# EAGLE design robot_board (EAGLE 9.1.0)
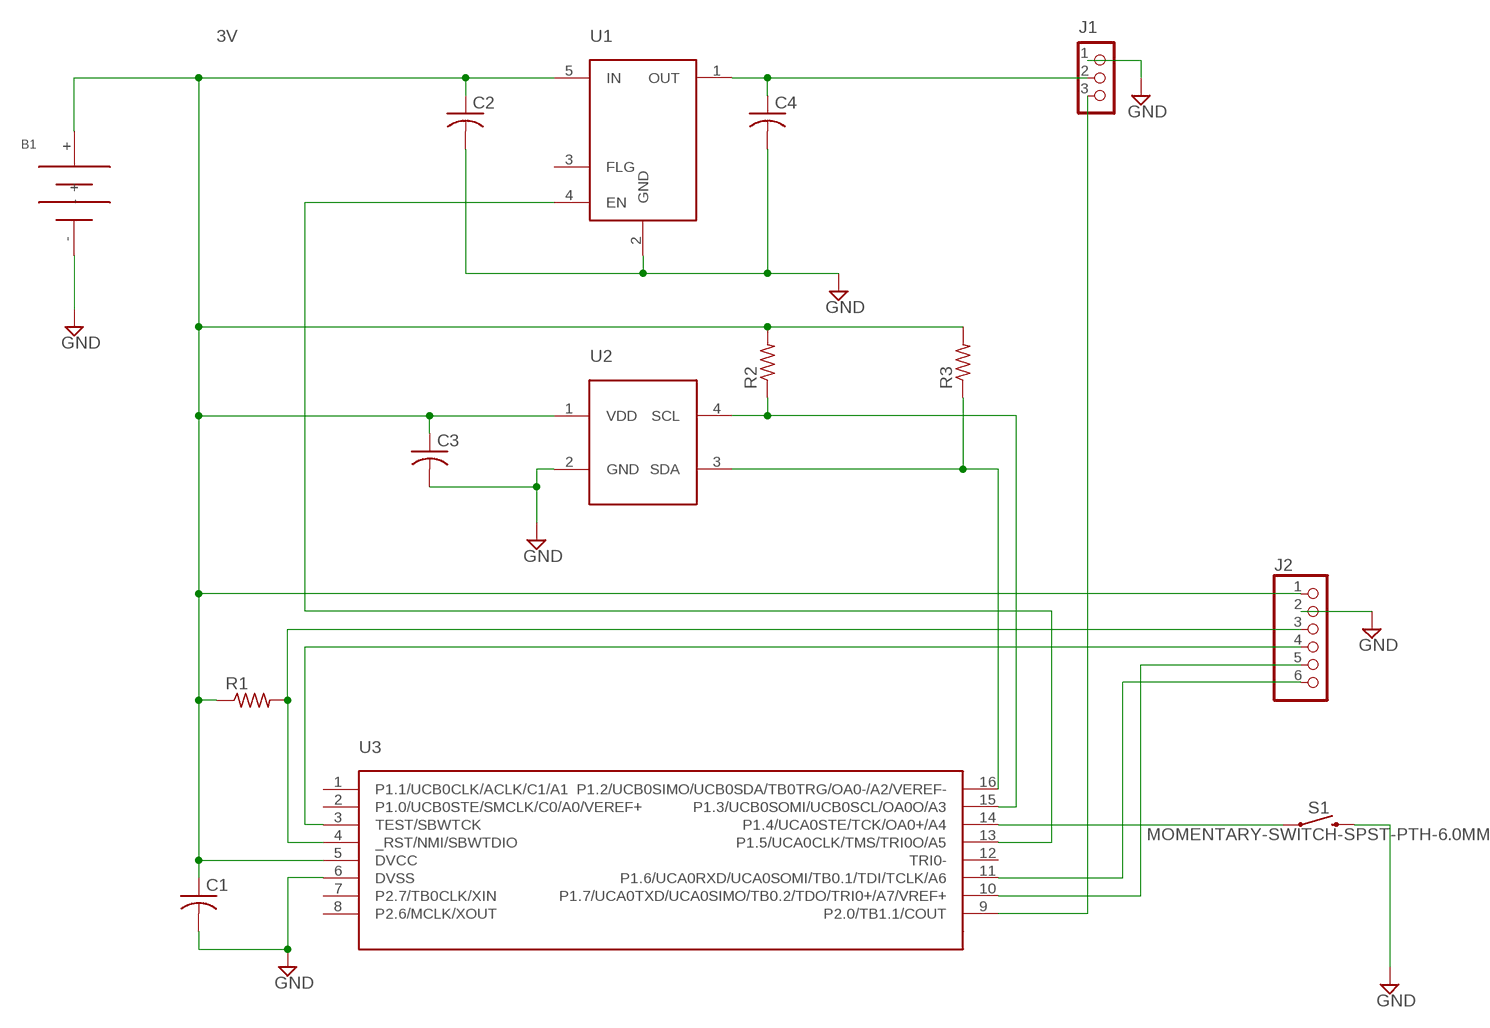
[diagram p0: schematic, sheet 1]

## Parts
B1  2XAAA_HOLDER  [CHEAP_ASS_CHINESE_BH]
C1  C-USC0805  [C0805]
C2  C-USC0805  [C0805]
C3  C-USC0805  [C0805]
C4  C-USC0805  [C0805]
J1  CON_HEADER_1X03-PTH_RIGHT_ANGLED  [M1X3_MALE_RIGHT_ANGLED]
J2  PINHD-1X6  [1X06]
R1  R-US_R0805  [R0805]
R2  R-US_R0805  [R0805]
R3  R-US_R0805  [R0805]
S1  MOMENTARY-SWITCH-SPST-PTH-6.0MM  [TACTILE_SWITCH_PTH_6.0MM]
U1  DI_AP22802AW5-7  [SOT-25]
U2  LITE-ON_LTR-329ALS-01  [LITE-ON_LTR-329ALS-01]
U3  TI_MSP430FR2310IPW16R  [PW_R-PDSO-G16]

## Nets
3V: B1.+ C1.1 C2.1 C3.1 J2.1 R1.1 R2.2 R3.2 U1.5(IN) U2.1(VDD) U3.5(DVCC)
GND: B1.- C1.2 C2.2 C3.2 C4.2 J1.1 J2.2 S1.3 U1.2(GND) U2.2(GND) U3.6(DVSS)
N$1: U1.4(EN) U3.13(P1.5/UCA0CLK/TMS/TRI0O/A5)
N$2: R2.1 U2.4(SCL) U3.15(P1.3/UCB0SOMI/UCB0SCL/OA0O/A3)
N$3: R3.1 U2.3(SDA) U3.16(P1.2/UCB0SIMO/UCB0SDA/TB0TRG/OA0-/A2/VEREF-)
N$4: C4.1 J1.2 U1.1(OUT)
N$6: J2.3 R1.2 U3.4(_RST/NMI/SBWTDIO)
N$7: J1.3 U3.9(P2.0/TB1.1/COUT)
N$8: J2.4 U3.3(TEST/SBWTCK)
N$9: J2.6 U3.11(P1.6/UCA0RXD/UCA0SOMI/TB0.1/TDI/TCLK/A6)
N$10: J2.5 U3.10(P1.7/UCA0TXD/UCA0SIMO/TB0.2/TDO/TRI0+/A7/VREF+)
N$11: S1.1 U3.14(P1.4/UCA0STE/TCK/OA0+/A4)
Unconnected: U1.3(FLG) U3.1(P1.1/UCB0CLK/ACLK/C1/A1) U3.2(P1.0/UCB0STE/SMCLK/C0/A0/VEREF+) U3.7(P2.7/TB0CLK/XIN) U3.8(P2.6/MCLK/XOUT) U3.12(TRI0-)

## Library data of the parts
B1 = pcb_robot:2XAAA_HOLDER
C1-C4 = pcb_robot:C-US: CAPACITOR, American symbol; SPICEPREFIX: C
J1 = pcb_robot:CON_HEADER_1X03
J2 = pinhead:PINHD-1X6: PIN HEADER
R1-R3 = rcl:R-US_: RESISTOR, American symbol; SPICEPREFIX: R
S1 = pcb_robot:MOMENTARY-SWITCH-SPST: Momentary Switch (Pushbutton) - SPST Normally-open (NO) SPST momentary switches (buttons, pushbuttons). Variants PTH-12MM - 12mm square, through-hole Momentary Pushbutton Switch - 12mm Square <https://www.sparkfun.com/products/9190> (COM-09190) PTH-6.0MM, PTH-6.0MM-KIT - 6.0mm square, through-hole Mini Pushbutton Switch <https://www.sparkfun.com/products/97> (COM-00097) KIT package intended for soldering kit's - only one side of pads' copper is exposed. PTH-RIGHT-ANGLE-KIT - Right-angle, through-hole Right Angle Tactile Button <https://www.sparkfun.com/products/10791> - Used on SparkFun BigTime Watch Kit <https://www.sparkfun.com/products/11734> SMD-12MM - 12mm square, surface-mount Tactile Button - SMD (12mm) <https://www.sparkfun.com/products/12993> (COM-12993) Used on SparkFun PicoBoard <https://www.sparkfun.com/products/11888> SMD-4.5MM - 4.5mm Square Trackball Switch Used on SparkFun Blackberry Trackballer Breakout <https://www.sparkfun.com/products/13169> SMD-4.6MMX2.8MM - 4.60mm x 2.80mm, surface mount Used on SparkFun SAMD21 Mini Breakout <https://www.sparkfun.com/products/13664> SMD-5.2MM, SMD-5.2-REDUNDANT - 5.2mm square, surface-mount Mini Pushbutton Switch - SMD <https://www.sparkfun.com/products/8720> (COM-08720) Used on Arduino Pro Mini <https://www.sparkfun.com/products/11114> REDUNDANT package connects both switch circuits together SMD-6.0X3.5MM - 6.0 x 3.5mm, surface mount Momentary Reset Switch SMD <https://www.sparkfun.com/products/8229> (COM-08229) SMD-6.2MM-TALL - 6.2mm square, surface mount Tactile Button - SMD (6mm) <https://www.sparkfun.com/products/12992> Used on SparkFun Digital Sandbox <https://www.sparkfun.com/products/12651> SMD-RIGHT-ANGLE - Right-angle, surface mount Used on SparkFun Block for Intel® Edison - Arduino <https://www.sparkfun.com/products/13036>; PROD_ID: SWCH-08441; SF_SKU: COM-00097
U1 = pcb_robot:DI_AP22802AW5-7
U2 = pcb_robot:LITE-ON_LTR-329ALS-01
U3 = pcb_robot:TI_MSP430FR2310IPW16R

## Board
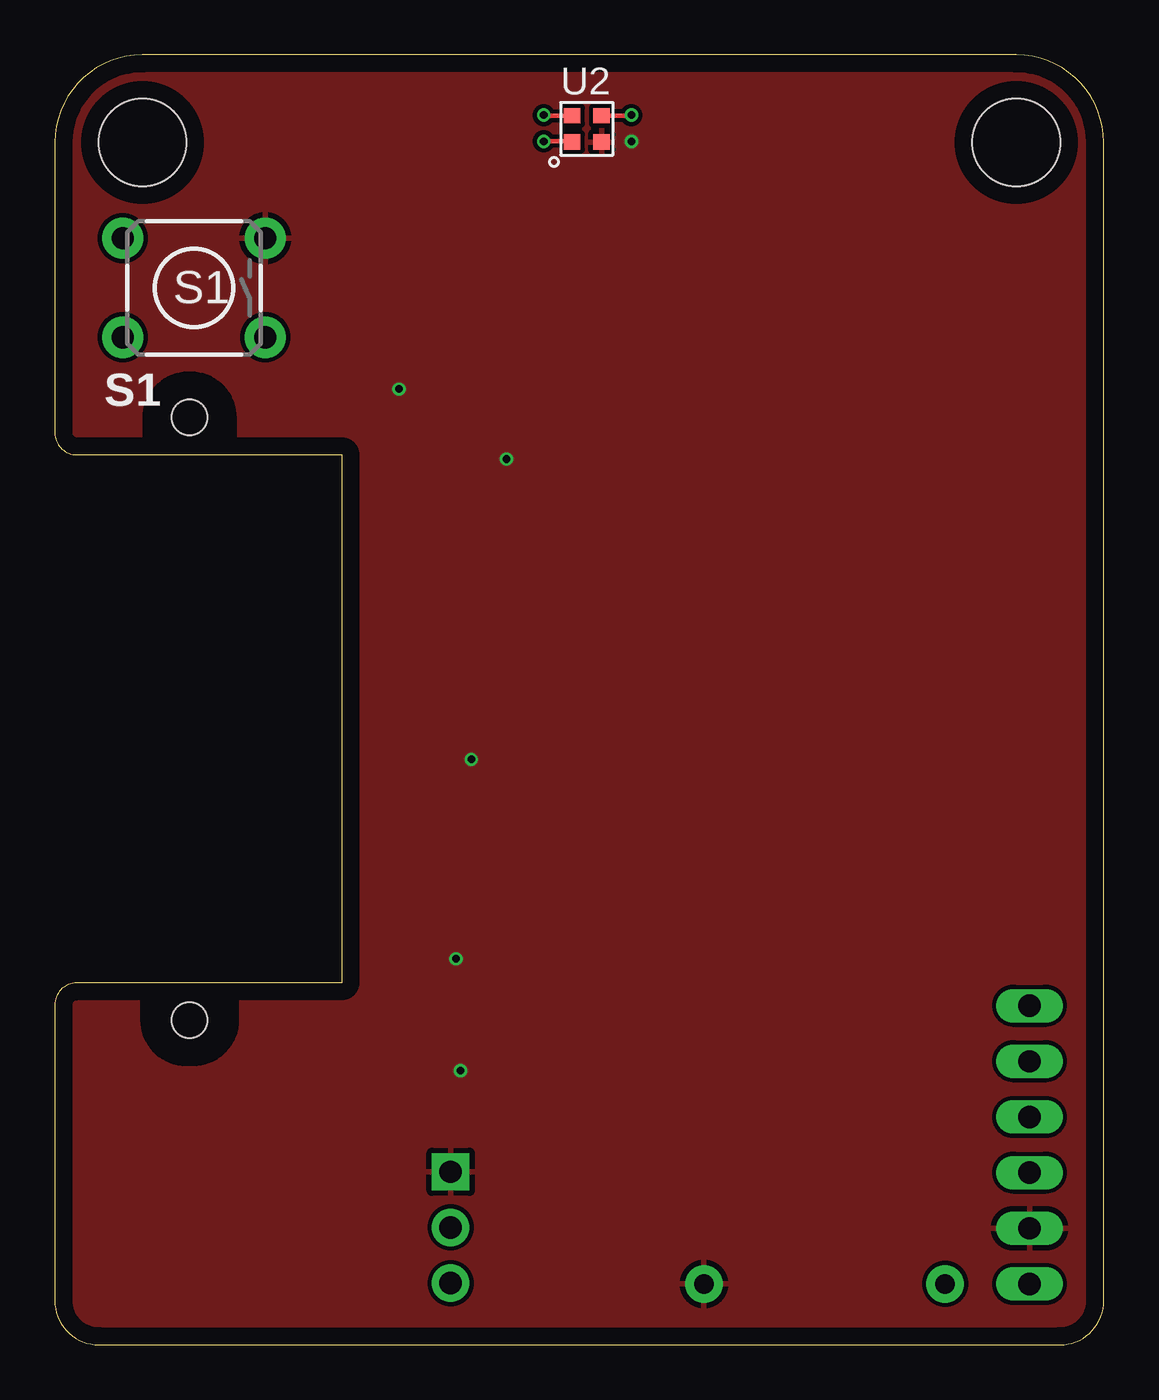
[diagram p1: board, top side]
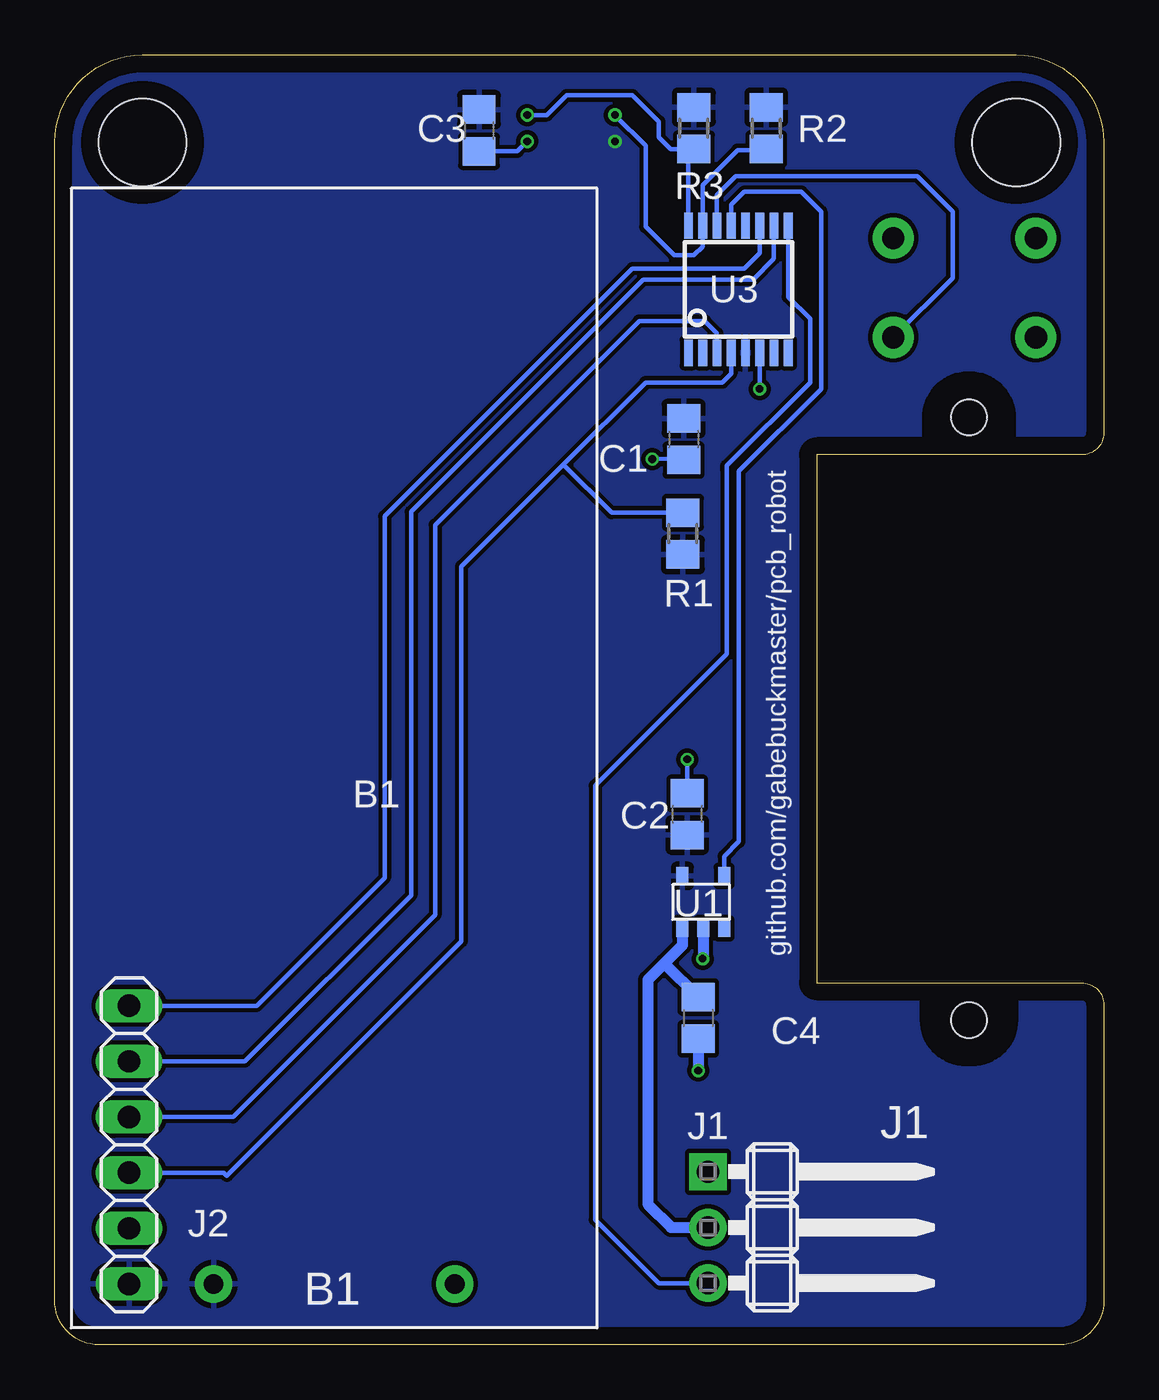
[diagram p2: board, bottom side, seen from below]

Size 47.85 x 58.86 mm. Coordinates in mm from the lower left corner, seen from the top.
Outline: 0,15.51 0,2 arc90 2,0 45.85,0 arc90 47.85,2 47.85,54.86 arc90 43.85,58.86 4,58.86 arc90 0,54.86 0,41.61 arc90 1,40.61 13.1,40.61 13.1,16.51 1,16.51 arc90 0,15.51
Copper layers (1*16): Top 0.035559375mm / dielectric 1.6mm / Bottom 0.035559375mm
Design rules "pcb_robot": minimum track width 6mil, minimum drill 10mil, track to track 6mil, track to pad 6mil, pad to pad 6mil, via to via 6mil, smd to smd 6mil, copper to edge 0.8mm, drill to drill 6mil, minimum pad ring 5mil, minimum via ring 5mil, stop-mask expansion 2.5mil, vias tented up to drill 0.4mm, thermal gap 10mil
Holes 4 mm at 4,54.86 43.85,54.86
Holes 1.6 mm at 6.15,42.31 6.15,14.81

### Footprints (pad centres in the part's own frame; a part is rotated, then mirrored left to right if it is on the bottom)
CHEAP_ASS_CHINESE_BH = drill 0.9 pad 1.7: + 5.5,0; - -5.5,0
C0805 = smd 1.3 x 1.5: 1 -0.95,0; 2 0.95,0
M1X3_MALE_RIGHT_ANGLED = drill 1.02 pad 1.7 square: 1 -2.54,-2.925 | drill 1.02 pad 1.7: 2 0,-2.925; 3 2.54,-2.925
1X06 = drill 1.016 long: 1 -6.35,0; 2 -3.81,0; 3 -1.27,0; 4 1.27,0; 5 3.81,0; 6 6.35,0
R0805 = smd 1.3 x 1.5: 1 -0.95,0; 2 0.95,0
TACTILE_SWITCH_PTH_6.0MM = drill 1.016 pad 1.88: 1 -3.251,2.261; 2 3.251,2.261; 3 -3.251,-2.261; 4 3.251,-2.261
SOT-25 = smd 0.55 x 0.8: 1 0.95,1.2; 2 0,1.2; 3 -0.95,1.2; 4 -0.95,-1.2; 5 0.95,-1.2
LITE-ON_LTR-329ALS-01 = smd 0.7 x 0.75: 1 -0.6,0.675; 2 -0.6,-0.675; 3 0.6,-0.675; 4 0.6,0.675
PW_R-PDSO-G16 = smd 0.4 x 1.2: 1 -2.275,-2.9; 2 -1.625,-2.9; 3 -0.975,-2.9; 4 -0.325,-2.9; 5 0.325,-2.9; 6 0.975,-2.9; 7 1.625,-2.9; 8 2.275,-2.9; 9 2.275,2.9; 10 1.625,2.9; 11 0.975,2.9; 12 0.325,2.9; 13 -0.325,2.9; 14 -0.975,2.9; 15 -1.625,2.9; 16 -2.275,2.9

### Placement (x,y rotation side)
B1  35.11,2.77 180 bottom
C1  19.17,41.32 270 bottom
C2  19,24.21 90 bottom
C3  28.5,55.41 270 bottom
C4  18.5,14.91 270 bottom
J1  15.13,5.35 270 bottom
J2  44.46,9.12 90 bottom
R1  19.2,37.01 90 bottom
R2  15.4,55.51 90 bottom
R3  18.7,55.51 90 bottom
S1  6.35,48.23 180 top
U1  18.27,20.2 180 bottom
U2  24.27,55.48 90 top
U3  16.67,48.16 0 bottom

### Tracks (layer width: path | path; a pad name or v marks a point on that pad's centre or on a via)
3V  (via drill 0.35)
  Top 0.2: U2.1 23.57,54.91 v22.3,54.91
  pour Bottom (isolate 0.2): -1.8,60.11 -1.8,-1.99 50.7,-1.99 50.7,60.11
GND  (via drill 0.35)
  Bottom 0.2: C3.2 26.75,54.46 v26.3,54.91 | C2.2 v19,26.71 | v15.7,43.61 v15.7,43.62 U3.6 | C1.2 19.24,40.44 v20.6,40.41
  Bottom 0.5: C4.2 v18.5,12.51 | U1.2 18.27,17.64 v18.3,17.61
  pour Top (isolate 0.2): -2,60.21 -2,-1.99 50.4,-1.99 50.4,60.21 -1.3,60.21
KEVIN
  cutout Bottom: 4.1,40.61 4.1,42.31 arc-90 6.1,44.31 6.2,44.31 arc-90 8.2,42.31 8.2,40.61
  cutout Top: 4.1,40.61 4.1,42.31 arc-90 6.1,44.31 6.2,44.31 arc-90 8.2,42.31 8.2,40.61
KEVIN2
  cutout Bottom: 4,16.51 4,14.81 arc90 6,12.81 6.1,12.81 6.3,12.81 arc90 8.3,14.81 8.3,16.51
  cutout Top: 4,16.51 4,14.81 arc90 6,12.81 6.1,12.81 6.3,12.81 arc90 8.3,14.81 8.3,16.51
N$1
  Bottom 0.2: U3.13 17,52.02 16.4,52.61 13.8,52.61 12.9,51.71 12.9,43.61 16.65,39.86 16.65,39.46 16.65,22.96 17.32,22.29 U1.4
N$2  (via drill 0.35)
  Top 0.2: v22.3,56.11 22.33,56.08 U2.4
  Bottom 0.2: R2.1 15.45,54.51 16.7,54.51 18.3,52.91 U3.15 18.3,50.12 18.7,49.71 19.6,49.71 20.9,51.01 20.9,54.71 v22.3,56.11
N$3  (via drill 0.35)
  Top 0.2: v26.3,56.11 26.27,56.08 U2.3
  Bottom 0.2: U3.16 18.95,53.11 18.95,54.31 R3.1 19.75,54.56 20.3,55.11 20.3,55.81 21.5,57.01 24.5,57.01 25.4,56.11 v26.3,56.11
N$4
  Bottom 0.5: J1.2 19.74,5.35 20.8,6.41 20.8,16.65 20.02,17.43 | U1.1 19.22,18.23 20.02,17.43 | C4.1 20.02,17.38 20.02,17.43
N$6
  Bottom 0.2: U3.4 17,44.31 17.4,43.91 20.9,43.91 24.65,40.16 | J2.3 40.14,7.85 40,7.71 29.3,18.41 29.3,35.51 24.65,40.16 | 24.65,40.16 22.45,37.96 R1.2
N$7
  Bottom 0.2: U3.9 14.39,47.8 13.4,46.81 13.4,43.91 17.2,40.11 17.2,39.91 17.2,31.51 23.2,25.51 23.2,5.71 20.3,2.81 J1.3
N$8
  Bottom 0.2: U3.3 17.64,46.16 18.2,46.71 21.2,46.71 30.5,37.41 30.5,19.61 39.72,10.39 J2.4
N$9
  Bottom 0.2: U3.11 15.7,49.81 16.4,49.11 21.5,49.11 32.8,37.81 32.8,21.31 38.64,15.47 J2.6
N$10
  Bottom 0.2: U3.10 15.04,49.56 16,48.61 21,48.61 31.6,38.01 31.6,20.51 39.18,12.93 J2.5
N$11
  Bottom 0.2: S1.1 6.9,48.67 6.9,51.71 8.5,53.31 16.8,53.31 17.64,52.46 U3.14

### Text on the board
tPlace: S1
bPlace: github.com/gabebuckmaster/pcb_robot | J1 | B1
Reference: Playa Circuit Boogie / Dewey & 4:15 / 2018